# Altium schematic sheet 100x100_3_czujniki_busbar.SchDoc
size A3; SheetNumber: 1; SheetTotal: 1
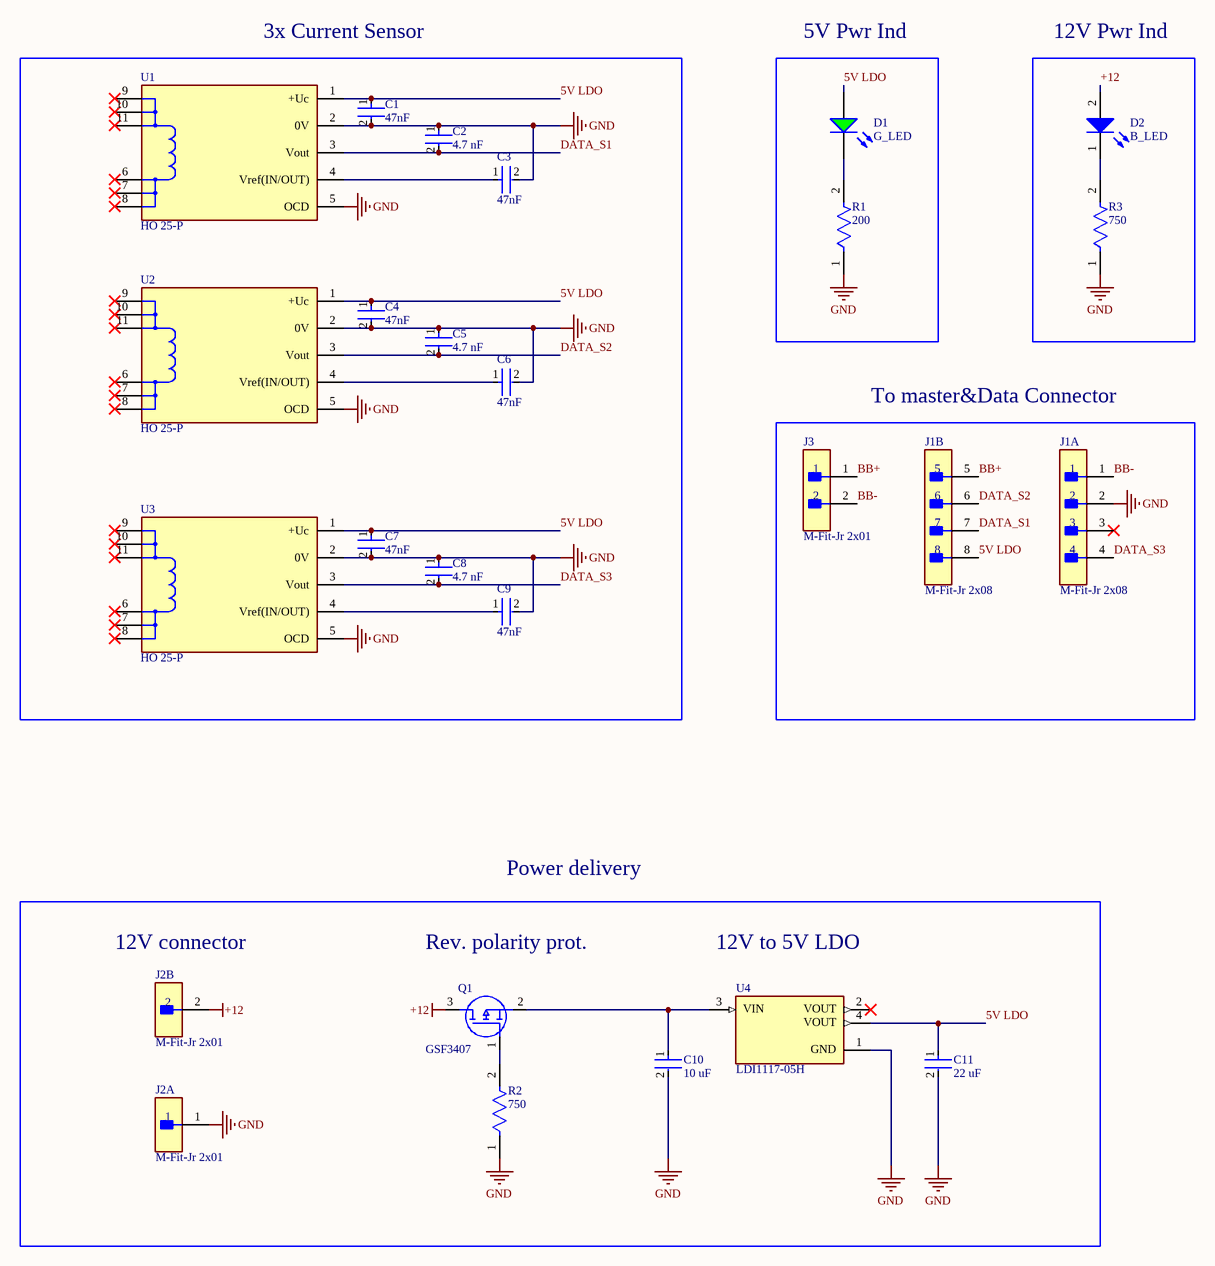
[diagram p0: 100x100_3_czujniki_busbar.SchDoc]

## Parts
C1  47nF  [FP-C1206C-EB-MFG]
C2  4.7 nF  [FP-C1206C-EB-MFG]
C3  47nF  [FP-C1206C-EB-MFG]
C4  47nF  [FP-C1206C-EB-MFG]
C5  4.7 nF  [FP-C1206C-EB-MFG]
C6  47nF  [FP-C1206C-EB-MFG]
C7  47nF  [FP-C1206C-EB-MFG]
C8  4.7 nF  [FP-C1206C-EB-MFG]
C9  47nF  [FP-C1206C-EB-MFG]
C10  10 uF  [FP-CL31-IPC_C]
C11  22 uF  [FP-CL31-IPC_C]
D1  G_LED  [LEDC3216X120N]
D2  B_LED  [WL-SMCW_1206_150120xx75000]
J1  M-Fit-Jr 2x08  [FP-87427-0802-MFG]  (parts A,B of 2)
J2  M-Fit-Jr 2x01  [FP-26-01-3114-MFG]  (parts A,B of 2)
J3  M-Fit-Jr 2x01  [FP-39-29-6028-MFG]
Q1  GSF3407  [GSF3407]
R1  200  [FP-AC1206-MFG]
R2  750  [FP-CRCW1206-e3-IPC_C]
R3  750  [FP-CRCW1206-e3-IPC_C]
U1  HO 25-P  [HO 25-P]
U2  HO 25-P  [HO 25-P]
U3  HO 25-P  [HO 25-P]
U4  LDI1117-05H  [LDI1117-05H]

## Blocks framed on the sheet
3x Current Sensor: C1-C9 U1-U3
5V Pwr Ind: D1 R1
12V Pwr Ind: D2 R3
To master&Data Connector: J1 J3

## Nets
+12: D2.2(A) J2.2 Q1.3(D)
GND: C1.2 C2.1 C3.2 C4.2 C5.1 C6.2 C7.2 C8.1 C9.2 C10.2 C11.2 J1.2 J2.1 R1.1 R2.1 R3.1 U1.2(0V) U1.5(OCD) U2.2(0V) U2.5(OCD) U3.2(0V) U3.5(OCD) U4.1
5V LDO: C1.1 C4.1 C7.1 C11.1 D1.1(A) J1.8 U1.1(+Uc) U2.1(+Uc) U3.1(+Uc) U4.4
BB+: J1.5 J3.1
BB-: J1.1 J3.2
DATA_S1: C2.2 J1.7 U1.3(Vout)
DATA_S2: C5.2 J1.6 U2.3(Vout)
DATA_S3: C8.2 J1.4 U3.3(Vout)
NetC3_1: C3.1 U1.4(Vref(IN/OUT))
NetC6_1: C6.1 U2.4(Vref(IN/OUT))
NetC9_1: C9.1 U3.4(Vref(IN/OUT))
NetC10_1: C10.1 Q1.2(S) U4.3
NetD1_2: D1.2(K) R1.2
NetD2_1: D2.1(K) R3.2
NetQ1_1: Q1.1(G) R2.2

Not connected (* = marked no-connect by the designer): J1 3*; U1 6(IN)* 7(IN)* 8(IN)* 9(OUT)* 10(OUT)* 11(OUT)*; U2 6(IN)* 7(IN)* 8(IN)* 9(OUT)* 10(OUT)* 11(OUT)*; U3 6(IN)* 7(IN)* 8(IN)* 9(OUT)* 10(OUT)* 11(OUT)*; U4 2*

## Notes on the sheet
- Power delivery
- 12V connector
- Rev. polarity prot.
- 12V to 5V LDO
- (in symbol LDI1117-05H) VIN; VOUT; GND

## Library data of the parts
C1 C3 C4 C6 C7 C9 = CMP-1037-03993-2: 0.047 µF ±5% 100V Ceramic Capacitor X7R 1206 (3216 Metric) C1206C473J1RACTU; Manufacturer: KEMET; Temperature Coefficient: 15%; Value: 47,000 pF; Tolerance: 0.05; Automotive Grade: Grade 0; Digikey Description: CAP CER 0.047UF 100V X7R 1206; ComponentLink2URL: https://content.kemet.com/datasheets/KEM_C1007_X8R_ULTRA_150C_SMD.pdf; Device Class L2: Capacitors; Height: 0.88mm; Package: C1206C-EB; Octopart: https://octopart.com/c1206c473j1ractu-kemet-8206881; Material: Ceramic; Temperature Range Low: -55°C; ComponentLink2Description: Datasheet; Mouser Description: Multilayer Ceramic Capacitors MLCC - SMD/SMT 100volts 47000pF X7R 5%; Temperature Characteristic: X7R; Lead Free: Yes; Manufacturer Part Number: C1206C473J1RACTU; Capacitance: 47,000 pF; Temperature Range High: +150°C; RoHS: TRUE; Voltage Rating: 100 V; Device Class L3: Ceramic Capacitors; Ipc Land Pattern Name: CAPC320160X78; Category: Cap; Automotive: Yes; Device Class L1: Passive Components; Temperature: -55°C to +150°C
C2 C5 C8 = CMP-03020-033478-1: 4700 pF ±5% 100V Ceramic Capacitor X7R 1206 (3216 Metric) C1206C472J1RACTU; Manufacturer: KEMET; Tolerance: 0.05; Automotive Grade: Grade 0; Capacitance: 4,700 pF; Temperature Coefficient: 15%; Value: 4,700 pF; Temperature Range Low: -55°C; ComponentLink2URL: https://content.kemet.com/datasheets/KEM_C1007_X8R_ULTRA_150C_SMD.pdf; Device Class L2: Capacitors; Device Class L3: Ceramic Capacitors; Manufacturer Part Number: C1206C472J1RACTU; Device Class L1: Passive Components; Temperature Characteristic: X7R; Temperature: -55°C to +150°C; Voltage Rating: 100 V; Digikey Description: CAP CER 4700PF 100V X7R 1206; Octopart: https://octopart.com/c1206c472j1ractu-kemet-4496506; Lead Free: Yes; Material: Ceramic; Mouser Description: Multilayer Ceramic Capacitors MLCC - SMD/SMT 100volts 4700pF X7R 5%; Category: Cap; Temperature Range High: +150°C; Package: C1206C-EB; Height: 0.88mm; RoHS: TRUE; Ipc Land Pattern Name: CAPC320160X78; Automotive: Yes; ComponentLink2Description: Datasheet
C10 = CMP-13271-000016-1: 10 µF ±10% 50V Ceramic Capacitor X5R 1206 (3216 Metric), CL31A106KBHNNNE; Manufacturer: Samsung; Value: 10uF; Temperature Coefficient: 15%; RoHS: TRUE; Ipc Land Pattern Name: CAPC320160X160; Temperature Range Low: -55°C; Device Class L3: Ceramic Capacitors; Category: Cap; Tolerance: 10%; Temperature Characteristic: X5R; Lead Free: Yes; Device Class L2: Capacitors; Octopart: https://octopart.com/cl31a106kbhnnne-samsung-19832778; Material: Ceramic; ComponentLink2Description: Datasheet; Digikey Description: CAP CER 10UF 50V X5R 1206; Voltage: 50V; ComponentLink2URL: http://www.samsungsem.com/kr/support/product-search/mlcc/__icsFiles/afieldfile/2018/06/21/CL31A106KBHNNNE.pdf; Capacitance: 10uF; Manufacturer Part Number: CL31A106KBHNNNE; Temperature Range High: +85°C; Device Class L1: Passive Components; Height: 1.8mm; Automotive: No; Voltage Rating: 50V; Package: CL31; Temperature: -55°C to +85°C
C11 = CMP-13271-002604-1: 22 µF ±10% 16V Ceramic Capacitor X5R 1206 (3216 Metric), CL31A226KOHNNNE; Capacitance: 22uF; Package Quantity: 1; Radiation Hardening: No; Thickness: 0.071inch; Case Code (Metric): 3216; Height: 1.6mm; Min Operating Temperature: -55°C; Width: 0.063inch; Mount: Surface Mount; Packaging: Tape and Reel; Depth: 1.6mm; Max Operating Temperature: 85°C; Dielectric: X5R; Case/Package: 1206; Lead Free: Lead Free; Tolerance: 10%; Case Code (Imperial): 1206; Length: 3.2mm; Voltage Rating (DC): 16V; Voltage Rating: 16V
D1 = LTST-C230KGKT: Green 571nm LED Indication - Discrete 2V 1206 (3216 Metric); Manufacturer: Lite-On; Forward Current: 30mA; Lens Color: Clear, Colorless; Lens Style: Clear; Luminous Intensity: 35mcd; Number of Circuits: 1; Peak Wavelength: 574nm; Power Dissipation: 75mW; Reverse Voltage: 5V; Shape: Rectangular; Test Current: 20mA; Viewing Angle: 130°; Supplier: RS; Supplier Part Number: 6921105P; Manufacturer Part Number: LTST-C230KGKT; RoHS: Compliant; Category: LEDs; Stock: 6300; Case/Package: 1206; Case Code (Imperial): 1206; Case Code (Metric): 3216; China RoHS: Compliant; Color: Green; Depth: 1.6mm; Dominant Wavelength: 571nm; Forward Voltage: 2V; Height: 1.1mm; Illumination Color: Green; Lead Free: Lead Free; Length: 3.2mm; Lens Transparency: Clear; Lifecycle Status: Production; Max Operating Temperature: 85°C; Min Operating Temperature: -55°C; Mounting Technology: Surface Mount; Number of Elements: 1; Number of LEDs: 1; Number of Terminals: 2; Power Rating: 75mW; Radiation Hardening: No; REACH SVHC: Yes; Schedule B: 8541402000, 8541402000|8541402000, 8541402000|8541402000|8541402000, 8541402000|8541402000|8541402000|8541402000; Terminal Pitch: 3.6mm; Wavelength: 574nm; Width: 1.6mm; ComponentLink1URL: https://datasheet.octopart.com:443/LTST-C230KGKT-Lite-On-datasheet-43775839.pdf?src-supplier=ODG+(Origin+Data+Global); ComponentLink1Description: https://datasheet.octopart.com:443/LTST-C230KGKT-Lite-On-datasheet-43775839.pdf?src-supplier=ODG+(Origin+Data+Global); ComponentLink2URL: https://datasheet.octopart.com:443/LTST-C230KGKT-Lite-On-datasheet-158343.pdf?src-supplier=Jameco; ComponentLink2Description: https://datasheet.octopart.com:443/LTST-C230KGKT-Lite-On-datasheet-158343.pdf?src-supplier=Jameco; ComponentLink3URL: https://datasheet.octopart.com:443/LTST-C230KGKT-Lite-On-datasheet-83115.pdf?src-supplier=Future+Electronics; ComponentLink3Description: https://datasheet.octopart.com:443/LTST-C230KGKT-Lite-On-datasheet-83115.pdf?src-supplier=Future+Electronics; ComponentLink4URL: https://datasheet.octopart.com:443/LTST-C230KGKT-Lite-On-datasheet-26684764.pdf?src-supplier=Future+Electronics; ComponentLink4Description: https://datasheet.octopart.com:443/LTST-C230KGKT-Lite-On-datasheet-26684764.pdf?src-supplier=Future+Electronics; ComponentLink5URL: https://datasheet.octopart.com:443/LTST-C230KGKT-Lite-On-datasheet-165573808.pdf?src-supplier=TME; ComponentLink5Description: https://datasheet.octopart.com:443/LTST-C230KGKT-Lite-On-datasheet-165573808.pdf?src-supplier=TME; ComponentLink6URL: https://datasheet.octopart.com:443/LTST-C230KGKT-Lite-On-datasheet-13697501.pdf?src-supplier=_legacy+Avnet; ComponentLink6Description: https://datasheet.octopart.com:443/LTST-C230KGKT-Lite-On-datasheet-13697501.pdf?src-supplier=_legacy+Avnet; ComponentLink7URL: https://datasheet.octopart.com:443/LTST-C230KGKT-Lite-On-datasheet-11795789.pdf?src-supplier=Arrow+Electronics; ComponentLink7Description: https://datasheet.octopart.com:443/LTST-C230KGKT-Lite-On-datasheet-11795789.pdf?src-supplier=Arrow+Electronics; Supplier 1: DigiKey; Supplier Part Number 1: 160-1456-1-ND
D2 = CMP-1426-00015-3: Blue 470nm LED Indication - Discrete 3.2V 1206 (3216 Metric), 150120BS75000; Manufacturer Package Identifier: LED_1206; Lens Style: Clear, Rectangular; Test Current: 20mA; Forward Current: 100mA; Peak Wavelength: 465nm; Max Reverse Voltage (DC): 5V; Viewing Angle: 140°; Luminous Intensity: 145mcd; Dominant Wavelength: 470nm; Max Operating Temperature: 85°C; Case Code (Imperial): 1206; Forward Voltage: 3.2V; Length: 3.2mm; Width: 1.6mm; Min Operating Temperature: -40°C; Height: 680µm; Case Code (Metric): 3216; Packaging: Tape and Reel; RoHS: Compliant; Case/Package: 1206; REACH SVHC: Unknown; Wavelength: 470nm; Mount: Surface Mount; Color: Blue
J1 = CMP-00257-00773328-1: Connector Header Through Hole, Right Angle 8 position 0.165" (4.20mm) 87427-0802; NexarPartId: 773328; Manufacturer Lifecycle Status: ACTIVE; Voltage Rating: 600V; Current Rating: 8A; Number of Positions: 8; Gender: Male; Insulation Resistance: 1GΩ; Number of Ports: 1; Glow Wire Compliant: Non-compliant; Pitch: 4.2mm; Plating: Tin; Radiation Hardening: No; Termination: Solder; Flammability Rating: UL94 V-0; Orientation: Right Angle, Vertical; Length: 19.2mm; RoHS: Compliant; Max Operating Temperature: 105°C; Number of Terminals: 8; Contact Plating: Tin; Contact Material: Brass; Country of Origin: IN; Schedule B: 8536694040; Voltage Rating (DC): 600V; Case/Package: 0802; Lead Pitch: 4.2mm; Min Operating Temperature: -40°C; Number of Pins: 8; Contact Gender: Male; Depth: 19.4mm; Number of Contacts: 8; Number of Circuits: 8; Mount: Through Hole; Color: Natural; Lifecycle Status: Production; Housing Material: Nylon; Number of Rows: 2; REACH SVHC: Unknown; Row Spacing: 4.2mm
J2 = CMP-04776-000291-1: Connector Header Through Hole, Right Angle 2 position, molex mini fit jr 26-01-3114; Voltage Rating: 600V; Current Rating: 13A; Row Spacing: 4.2mm; Number of Positions: 2; Number of Ports: 1; Halogen Free: Low Halogen; Length: 5.4mm; Number of Rows: 2; Series: 5569; Material: Brass; Min Operating Temperature: -40°C; Contact Gender: Male; Mount: Through Hole; Package Quantity: 2280; Termination: Through Hole; Contact Material: Brass; Packaging: Bulk; Flammability Rating: UL94 V-2; Number of Terminals/Pins: 2; Orientation: Right Angle; Max Operating Temperature: 105°C; Depth: 19.93mm; ELV: Compliant; Pitch: 4.2mm; Housing Material: Nylon; Contact Plating: Gold
J3 = CMP-04776-000768-1: 39-29-6028 Connector Header Through Hole 2 position; Max Voltage Rating (DC): 600.6kV; Contact Resistance: 10mR; Current Rating: 9A; Glow Wire Compliant: Non-compliant; Gender: Male; Number of Positions: 2; Row Spacing: 4.2mm; Voltage Rating: 600V; Contact Plating: Gold; Min Operating Temperature: -40°C; Orientation: Straight; Contact Material: Brass; Lead Free: Lead Free; Packaging: Bulk; Pitch: 4.2mm; Number of Circuits: 2; Series: Mini-Fit Jr.; Number of Contacts: 2; Halogen Free: Low Halogen; Radiation Hardening: No; Mount: Through Hole; Housing Material: Nylon; Contact Gender: Male; Termination: Solder; Max Operating Temperature: 105°C; Number of Rows: 2
Q1 = GSF3407: Mosfet, P-ch, Single, -4.1A, -30; Manufacturer: Good-Ark; Supplier: DigiKey; Supplier Part Number: 4786-GSF3407CT-ND; Manufacturer Part Number: GSF3407; Category: MOSFETs; Stock: 10489; Pricing: 1=0,1, 10=0,064, 25=0,0564, 100=0,0471, 250=0,0428, 500=0,0402, 1000=0,03806 (USD)
R1 = CMP-03412-013792-1: 200 Ohms ±1% 0.25W, 1/4W Chip Resistor 1206 (3216 Metric) Automotive AEC-Q200, Moisture Resistant Thick Film AC1206FR-07200RL; Manufacturer: Yageo; Resistance: 200Ω; Automotive Grade: Grade 0; Value: 200Ω; Tolerance: 0.01; Voltage Rating: 200V; Device Class L2: Resistors; Power Rating: 0.25W; Package: AC1206; Temperature Range High: +155°C; Device Class L1: Passive Components; ComponentLink2URL: http://www.yageo.com/NewPortal/yageodocoutput?fileName=/pdf/R-Chip/PYu-AC_51_RoHS_L_6.pdf; Manufacturer Part Number: AC1206FR-07200RL; Footprint Url: http://www.yageo.com/exep/pages/download/literatures/PYu-R_Mount_10.pdf; Device Class L3: Chip SMD Resistors; Series: AC; RoHS: TRUE; Mouser Description: Thick Film Resistors - SMD 1/4W 200ohm 1% AEC-Q200; Height: 0.65mm; Digikey Description: RES SMD 200 OHM 1% 1/4W 1206; Lead Free: Yes; Ipc Land Pattern Name: RESC310160X55; ComponentLink2Description: Datasheet; Category: Res; Temperature: -55°C to +155°C; Automotive: Yes; Composition: Thick Film; Temperature Range Low: -55°C; Octopart: https://octopart.com/ac1206fr-07200rl-yageo-30511076
R2 R3 = CMP-2003-02375-2: 750 Ohms ±5% 0.25W, 1/4W Chip Resistor 1206 (3216 Metric) Automotive AEC-Q200 Thick Film, CRCW1206750RJNEA; Power Rating: 250mW; Resistance: 750R; Voltage Rating (DC): 200V; Temperature Coefficient: 200ppm/°C; Features: Automotive AEC-Q200; Contact Plating: Tin; Depth: 1.6mm; Width: 0.063inch; Military Standard: Not; Tolerance: 5%; Number of Terminations: 2; Radiation Hardening: No; Length: 3.2mm; Lead Free: Lead Free; Voltage Rating: 200V; Case Code (Imperial): 1206; Height: 0.024inch; Packaging: Tape and Reel; Mount: Surface Mount; Case/Package: 1206; Case Code (Metric): 3216; Min Operating Temperature: -55°C; Composition: Thick Film; Package Quantity: 1; Max Operating Temperature: 155°C; Weight: 0.000353oz; Max Power Dissipation: 250mW
U1-U3 = CMP-010-00025-1: Open Loop Current Sensor AC/DC Current 5V Automotive; Current Sensing: 25A; Accuracy: 1.4%; Number of Channels: 1; Polarity: Bidirectional; Min Supply Voltage (DC): 4.5V; Max Supply Voltage (DC): 5.5V; Linearity: 0.5%; Max Supply Current: 25mA; Frequency: 250kHz; Response Time: 3.5µs; RoHS: Compliant; REACH SVHC: Yes; Mounting Technology: Through Hole; Lifecycle Status: Production; Min Operating Temperature: -40°C; Max Operating Temperature: 105°C
U4 = LDI1117-05H: Fixed Positive LDO Regulator; Manufacturer: Diotec; Supplier: Farnell; Supplier Part Number: 4553249; Manufacturer Part Number: LDI1117-05H; RoHS: No; Category: Voltage Regulators - Linear; Stock: 720; RoHS Compliant: Yes; ComponentLink1URL: http://datasheet.octopart.com/LDI1117-05H-Diotec-datasheet-154607892.pdf?src-supplier=Mouser; ComponentLink1Description: http://datasheet.octopart.com/LDI1117-05H-Diotec-datasheet-154607892.pdf?src-supplier=Mouser; ComponentLink2URL: http://datasheet.octopart.com/LDI1117-05H-Diotec-datasheet-154607892.pdf?src-supplier=Distrelec; ComponentLink2Description: http://datasheet.octopart.com/LDI1117-05H-Diotec-datasheet-154607892.pdf?src-supplier=Distrelec; ComponentLink3URL: http://datasheet.octopart.com/LDI1117-05H-Diotec-datasheet-154607892.pdf?src-supplier=Onlinecomponents.com; ComponentLink3Description: http://datasheet.octopart.com/LDI1117-05H-Diotec-datasheet-154607892.pdf?src-supplier=Onlinecomponents.com; ComponentLink4URL: http://datasheet.octopart.com/LDI1117-05H-Diotec-datasheet-154607892.pdf?src-supplier=DComponents; ComponentLink4Description: http://datasheet.octopart.com/LDI1117-05H-Diotec-datasheet-154607892.pdf?src-supplier=DComponents; ComponentLink5URL: https://datasheet.octopart.com/LDI1117-05H-Diotec-datasheet-154607892.pdf?src-supplier=TME; ComponentLink5Description: https://datasheet.octopart.com/LDI1117-05H-Diotec-datasheet-154607892.pdf?src-supplier=TME; ComponentLink6URL: https://datasheet.octopart.com/LDI1117-05H-Diotec-datasheet-159101088.pdf?src-supplier=SOS+electronic; ComponentLink6Description: https://datasheet.octopart.com/LDI1117-05H-Diotec-datasheet-159101088.pdf?src-supplier=SOS+electronic; ComponentLink7URL: http://datasheet.octopart.com/LDI1117-05H-Diotec-datasheet-154607892.pdf?src-supplier=Electro+Sonic; ComponentLink7Description: http://datasheet.octopart.com/LDI1117-05H-Diotec-datasheet-154607892.pdf?src-supplier=Electro+Sonic; ComponentLink8URL: https://datasheet.octopart.com/LDI1117-05H-Diotec-datasheet-189099648.pdf?src-supplier=Master+Electronics; ComponentLink8Description: https://datasheet.octopart.com/LDI1117-05H-Diotec-datasheet-189099648.pdf?src-supplier=Master+Electronics